# Altium project pca10059.PrjPCB
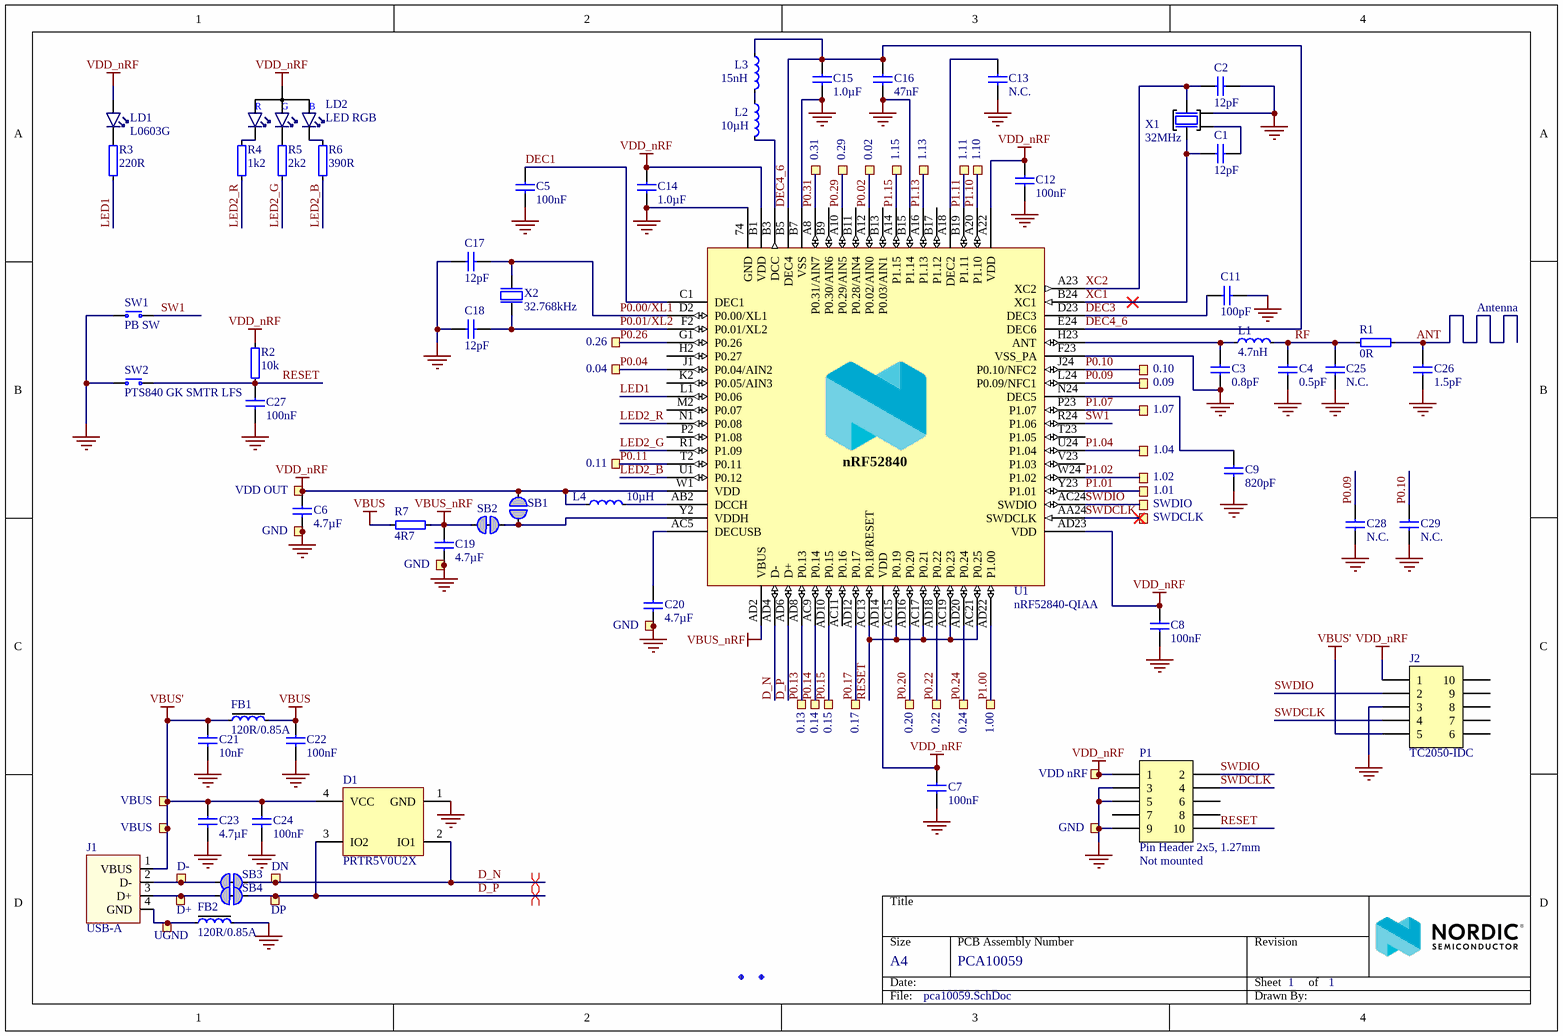
[diagram p0: pca10059.SchDoc]
SurfaceFinish: ENIG; SoldermaskColor: Blue; SilkscreenColor: White; PCARevision: 2.1.1; ProductName: nRF52840 Dongle; PCBRevision: 0379RUBR; PCBNumber: 400250; PCAName: PCA10059; Organization: Nordic Semiconductor; NrOfLayers: 2; BoardTitle: nRF52840 USB Dongle; BoardThickness: 2.0mm; Designer: RUBR; Compliance: RoHS, REACH, Halogen-Free; Dielectric: FR-4 Halogen-Free
1 sheet, 97 parts. Net scope: global (net labels, ports and power ports of the same name join across sheets).
Board file: 400250.PcbDoc

## Sheet pca10059.SchDoc: =BoardTitle
size A4; Organization: Nordic Semiconductor; Revision: 2.1.1; SheetNumber: 1; SheetTotal: 1; Author: RUBR; CompanyName: Nordic Semiconductor; DrawnBy: RUBR; DocumentSize: A4

### Parts
0.02  CH  [Castellated_Hole_0.9mm]  (value not drawn)  (no BOM)
0.04  Ø1.0mm,SMD  [TP_SMD_D1.0mm]  (value not drawn)  (no BOM)
0.09  CH  [Castellated_Hole_0.9mm]  (value not drawn)  (no BOM)
0.10  CH  [Castellated_Hole_0.9mm]  (value not drawn)  (no BOM)
0.11  Ø1.0mm,SMD  [TP_SMD_D1.0mm]  (value not drawn)  (no BOM)
0.13  CH  [Castellated_Hole_0.9mm]  (value not drawn)  (no BOM)
0.14  Ø1.0mm,SMD  [TP_SMD_D1.0mm]  (value not drawn)  (no BOM)
0.15  CH  [Castellated_Hole_0.9mm]  (value not drawn)  (no BOM)
0.17  CH  [Castellated_Hole_0.9mm]  (value not drawn)  (no BOM)
0.20  CH  [Castellated_Hole_0.9mm]  (value not drawn)  (no BOM)
0.22  CH  [Castellated_Hole_0.9mm]  (value not drawn)  (no BOM)
0.24  CH  [Castellated_Hole_0.9mm]  (value not drawn)  (no BOM)
0.26  Ø1.0mm,SMD  [TP_SMD_D1.0mm]  (value not drawn)  (no BOM)
0.29  CH  [Castellated_Hole_0.9mm]  (value not drawn)  (no BOM)
0.31  CH  [Castellated_Hole_0.9mm]  (value not drawn)  (no BOM)
1.00  CH  [Castellated_Hole_0.9mm]  (value not drawn)  (no BOM)
1.01  Ø1.0mm,SMD  [TP_SMD_D1.0mm]  (value not drawn)  (no BOM)
1.02  Ø1.0mm,SMD  [TP_SMD_D1.0mm]  (value not drawn)  (no BOM)
1.04  Ø1.0mm,SMD  [TP_SMD_D1.0mm]  (value not drawn)  (no BOM)
1.07  Ø1.0mm,SMD  [TP_SMD_D1.0mm]  (value not drawn)  (no BOM)
1.10  CH  [Castellated_Hole_0.9mm]  (value not drawn)  (no BOM)
1.11  Ø1.0mm,SMD  [TP_SMD_D1.0mm]  (value not drawn)  (no BOM)
1.13  CH  [Castellated_Hole_0.9mm]  (value not drawn)  (no BOM)
1.15  CH  [Castellated_Hole_0.9mm]  (value not drawn)  (no BOM)
C1  12pF  [CAPC0603X03L_C]
C2  12pF  [CAPC0603X03L_C]
C3  0.8pF  [CAPC0603X03L_C]
C4  0.5pF  [CAPC0603X03L_C]
C5  100nF  [CAPC0603X03L_C]
C6  4.7µF  [CAPC1608X06L]
C7  100nF  [CAPC0603X03L_C]
C8  100nF  [CAPC0603X03L_C]
C9  820pF  [CAPC0603X03L_C]
C11  100pF  [CAPC0603X03L_C]
C12  100nF  [CAPC0603X03L_C]
C13  N.C.  [CAPC0603X03L_C_NC]
C14  1.0µF  [CAPC1608X06L]
C15  1.0µF  [CAPC1608X06L]
C16  47nF  [CAPC0603X03L_C]
C17  12pF  [CAPC0603X03L_C]
C18  12pF  [CAPC0603X03L_C]
C19  4.7µF  [CAPC1005X04L]
C20  4.7µF  [CAPC1608X06L]
C21  10nF  [CAPC0603X03L_C]
C22  100nF  [CAPC0603X03L_C]
C23  4.7µF  [CAPC1005X04L]
C24  100nF  [CAPC0603X03L_C]
C25  N.C.  [CAPC0603X03L_C_NC]
C26  1.5pF  [CAPC0603X03L_C]
C27  100nF  [CAPC0603X03L_C]
C28  N.C.  [CAPC1005X04L_NC]
C29  N.C.  [CAPC1005X04L_NC]
D1  PRTR5V0U2X  [SOT190P230X110-4L]
D+  Ø1.0mm,SMD  [TP_SMD_D1.0mm]  (value not drawn)  (no BOM)
D-  Ø1.0mm,SMD  [TP_SMD_D1.0mm]  (value not drawn)  (no BOM)
DN  Ø1.0mm,SMD  [TP_SMD_D1.0mm]  (value not drawn)  (no BOM)
DP  Ø1.0mm,SMD  [TP_SMD_D1.0mm]  (value not drawn)  (no BOM)
FB1  120R/0.85A  [INDC0603X03L_C]
FB2  120R/0.85A  [INDC0603X03L_C]
Fid1  Fiducial mark  [Fiducial_Square]  (value not drawn)
Fid2  Fiducial mark  [Fiducial]  (value not drawn)
GND1  GND  [Castellated_Hole_0.9mm]  (no BOM)
GND2  GND  [Castellated_Hole_0.9mm_S]  (no BOM)
GND3  GND  [Castellated_Hole_0.9mm_S]  (no BOM)
GND4  GND  [TP_SMD_D1.0mm]  (no BOM)
J1  USB-A  [USB-A-PCB]  (no BOM)
J2  TC2050-IDC  [TC2050-IDC-NLFP]  (no BOM)
L1  4.7nH  [INDC0603X03L_C]
L2  10µH  [INDC1608X06L]
L3  15nH  [INDC1005X04L]
L4  10µH  [INDC1608X06L]
LD1  L0603G  [LED_0603_G]
LD2  LED RGB  [LED_RGB_0603]
P1  Pin Header 2x5, 1.27mm  Assembly: Not mounted  [HDR_2x5-SMD-1.27mm-NC]
R1  0R  [RESC0603X03L_C]
R2  10k  [RESC0603X03L_C]
R3  220R  [RESC0603X03L_C]
R4  1k2  [RESC0603X03L_C]
R5  2k2  [RESC0603X03L_C]
R6  390R  [RESC0603X03L_C]
R7  4R7  [RESC0603X03L_C]
SB1  Solderbridge  [Solderbridge]  (value not drawn)  (no BOM)
SB2  Solderbridge  [Solderbridge_Shorted]  (value not drawn)  (net tie, no BOM)
SB3  Solderbridge  [Solderbridge_Shorted]  (value not drawn)  (net tie, no BOM)
SB4  Solderbridge  [Solderbridge_Shorted]  (value not drawn)  (net tie, no BOM)
SW1  PB SW  [C&K_PTS810]
SW2  PTS840 GK SMTR LFS  [EVQP7A_J_B_K]
SWDCLK  CH  [Castellated_Hole_0.9mm_D]  (value not drawn)  (no BOM)
SWDIO  CH  [Castellated_Hole_0.9mm_D]  (value not drawn)  (no BOM)
U1  nRF52840-QIAA  [AQFN50P700X700X85_HS-74N]
UGND  Ø1.0mm,SMD  [TP_SMD_D1.0mm]  (value not drawn)  (no BOM)
VBUS1  VBUS  [Castellated_Hole_0.9mm]  (no BOM)
VBUS2  VBUS  [TP_SMD_D1.0mm]  (no BOM)
VDD_nRF  Ø1.0mm,SMD  [TP_SMD_D1.0mm]  (value not drawn)  (no BOM)
VDD_OUT  CH  [Castellated_Hole_0.9mm]  (value not drawn)  (no BOM)
X1  32MHz  [BT-XTAL_2016]
X2  32.768kHz  [XTAL_2012]

### Nets
GND: C2.2 C3.1 C4.1 C5.2 C6.2 C7.2 C8.2 C9.2 C11.2 C12.2 C13.2 C14.2 C15.1 C16.2 C17.2 C18.2 C19.2 C20.2 C21.1 C22.1 C23.1 C24.1 C25.2 C26.1 C27.1 C28.1 C29.2 D1.1(GND) FB2.2 GND1.1 GND2.1 GND3.1 GND4.1 J2.3 P1.3 P1.5 P1.9 SW1.2(COM) SW2.2(COM) U1.74(GND) U1.B7(VSS) U1.B15(P1.14) U1.F23(VSS_PA) X1.2(GND)
VBUS: C22.2 FB1.2 R7.2
VBUS': C21.2 C23.2 C24.2 D1.4(VCC) FB1.1 J1.1(VBUS) J2.5 VBUS1.1 VBUS2.1
VBUS_nRF: C19.1 R7.1 SB2.2 U1.AD2(VBUS)
VDD_nRF: C6.1 C7.1 C8.1 C12.1 C14.1 J2.1 L4.1 LD1.2(A) LD2.4(A) P1.1 R2.2 SB1.1 U1.A22(VDD) U1.AD14(VDD) U1.AD23(VDD) U1.B1(VDD) U1.W1(VDD) VDD_nRF.1 VDD_OUT.1
ANT: C26.2 R1.2
D_N: D1.2(IO1) DN.1 SB3.1 U1.AD4(D-)
D_P: D1.3(IO2) DP.1 SB4.1 U1.AD6(D+)
DEC1: C5.1 U1.C1(DEC1)
DEC3: C11.1 U1.D23(DEC3)
DEC4_6: C15.2 C16.1 L3.1 U1.B5(DEC4) U1.E24(DEC6)
LED1: R3.1 U1.L1(P0.06)
LED2_B: R6.1 U1.U1(P0.12)
LED2_G: R5.1 U1.R1(P1.09)
LED2_R: R4.1 U1.N1(P0.08)
P0.00/XL1: C17.1 U1.D2(P0.00/XL1) X2.1(inp)
P0.01/XL2: C18.1 U1.F2(P0.01/XL2) X2.2(out)
P0.02: 0.02.1 U1.A12(P0.02/AIN0)
P0.04: 0.04.1 U1.J1(P0.04/AIN2)
P0.09: 0.09.1 C28.2 U1.L24(P0.09/NFC1)
P0.10: 0.10.1 C29.1 U1.J24(P0.10/NFC2)
P0.11: 0.11.1 U1.T2(P0.11)
P0.13: 0.13.1 U1.AD8(P0.13)
P0.14: 0.14.1 U1.AC9(P0.14)
P0.15: 0.15.1 U1.AD10(P0.15)
P0.17: 0.17.1 U1.AD12(P0.17)
P0.20: 0.20.1 U1.AD16(P0.20)
P0.22: 0.22.1 U1.AD18(P0.22)
P0.24: 0.24.1 U1.AD20(P0.24)
P0.26: 0.26.1 U1.G1(P0.26)
P0.29: 0.29.1 U1.A10(P0.29/AIN5)
P0.31: 0.31.1 U1.A8(P0.31/AIN7)
P1.00: 1.00.1 U1.AD22(P1.00)
P1.01: 1.01.1 U1.Y23(P1.01)
P1.02: 1.02.1 U1.W24(P1.02)
P1.04: 1.04.1 U1.U24(P1.04)
P1.07: 1.07.1 U1.P23(P1.07)
P1.10: 1.10.1 U1.A20(P1.10)
P1.11: 1.11.1 U1.B19(P1.11)
P1.13: 1.13.1 U1.A16(P1.13)
P1.15: 1.15.1 U1.A14(P1.15)
RESET: C27.2 P1.10 R2.1 SW2.1(N.O) U1.AC13(P0.18/RESET) U1.AC15(P0.19) U1.AC17(P0.21) U1.AC19(P0.23) U1.AC21(P0.25)
RF: C4.2 C25.1 L1.2 R1.1
SW1: SW1.1(N.O) U1.R24(P1.06)
SWDCLK: J2.4 P1.4 SWDCLK.1 U1.AA24(SWDCLK)
SWDIO: J2.2 P1.2 SWDIO.1 U1.AC24(SWDIO)
XC1: C1.1 U1.B24(XC1) X1.1(IN)
XC2: C2.1 U1.A23(XC2) X1.3(OUT)
NetC1_2: C1.2 X1.4(GND)
NetC3_2: C3.2 L1.1 U1.H23(ANT)
NetC9_1: C9.1 U1.N24(DEC5)
NetC13_1: C13.1 U1.A18(DEC2)
NetC20_1: C20.1 U1.AC5(DECUSB)
NetD+_1: D+.1 J1.3(D+) SB4.2
NetD-_1: D-.1 J1.2(D-) SB3.2
NetFB2_1: FB2.1 J1.4(GND) UGND.1
NetL2_1: L2.1 L3.2
NetL2_2: L2.2 U1.B3(DCC)
NetL4_2: L4.2 U1.AB2(DCCH)
NetLD1_1: LD1.1(C) R3.2
NetLD2_1: LD2.1(C_RED) R4.2
NetLD2_2: LD2.2(C_GREEN) R5.2
NetLD2_3: LD2.3(C_BLUE) R6.2
NetSB1_2: SB1.2 SB2.1 U1.Y2(VDDH)

Not connected (* = marked no-connect by the designer): J2 6 7 8 9 10; P1 6 7 8; U1 AC11(P0.16) B9(P0.30/AIN6) B11(P0.28/AIN4) B13(P0.03/AIN1) B17(P1.12) H2(P0.27) K2(P0.05/AIN3) M2(P0.07) P2(P1.08) T23(P1.05) V23(P1.03)

### Layout directives
differential pair: D_N, D_P

### Notes on the sheet
- Antenna
- Title
- Size
- Date:
- A4
- PCB Assembly Number
- Sheet         of
- Revision
- File:
- Drawn By:
- (in symbol APHF1608LSEEQBDZGKC) R; G; B
- (in symbol nRF52840-QIAAF0) nRF52840

### Library data of the parts
0.02 0.09 0.10 0.13 0.15 0.17 0.20 0.22 0.24 0.29 0.31 1.00 1.10 1.13 1.15 GND1 VBUS1 VDD_OUT = Castellated Hole 0.9mm: Manufacturer: N.A.; Pad Count: 1; Part Number: Castellated Hole 0.9mm; Manufacturer Part Number: N.A.; LatestRevisionDate: 2016-08-22; Published: 2016-08-22; Note: N.A.; Artikkelnr Noca: N.A.; Part number IPS: N.A.; ComponentLink1Description: Datasheet; ComponentLink1URL: N.A.; ComponentLink2Description: Supplier link; ComponentLink2URL: N.A.; HelpURL: N.A.; Supplier 1: N.A.; Supplier Part Number 1: N.A.; Supplier 2: N.A.; Supplier Part Number 2: N.A.; Footprint Doc: N.A.; PartId: 100500565; Component Class: Connectors; Author: rsk; Part number Norautron: N.A.
  0.02 0.09 0.10 0.13 0.15 0.17 0.20 0.22 0.24 0.29 0.31 1.00 1.10 1.13 1.15 VDD_OUT: Value: CH
  GND1: Value: GND
  VBUS1: Value: VBUS
0.04 0.11 0.14 0.26 1.01 1.02 1.04 1.07 1.11 D+ D- DN DP GND4 UGND VBUS2 VDD_nRF = TP_SMD_Ø1.0MM: 1.0mm circular SMD testpad; Manufacturer: Nordic Semiconductor; Manufacturer Part Number: N.A.; Pad Count: 1; Part Number: TP_SMD_Ø1.0MM; Footprint Doc: TP_SMD_Ø1.0mm; LatestRevisionDate: 2021-03-05; Published: 2013-06-11; Note: N.A.; Artikkelnr Noca: N.A.; Part number IPS: N.A.; ComponentLink1Description: Datasheet; ComponentLink1URL: N.A.; ComponentLink2Description: Supplier link; ComponentLink2URL: N.A.; HelpURL: N.A.; Supplier 1: N.A.; Supplier Part Number 1: N.A.; Supplier 2: N.A.; Supplier Part Number 2: N.A.; PartId: 100500475; Component Class: Connectors; Author: rsk; Part number Norautron: N.A.
  0.04 0.11 0.14 0.26 1.01 1.02 1.04 1.07 1.11 D+ D- DN DP UGND VDD_nRF: Value: Ø1.0mm,SMD
  GND4: Value: GND
  VBUS2: Value: VBUS
C1 C2 C17 C18 = C0201-12p: Capacitor, NP0, ±2%; Manufacturer: N.A.; Part number IPS: 00000007848; Note: 25V; Pad Count: 2; Part Number: C0201-12p; Manufacturer Part Number: N.A.; LatestRevisionDate: 2017-11-09; Published: 2014-11-13; Value: 12pF; Artikkelnr Noca: N.A.; Footprint Doc: 0201; ComponentLink1Description: Datasheet; ComponentLink1URL: N.A.; ComponentLink2Description: Supplier link; ComponentLink2URL: N.A.; HelpURL: N.A.; Supplier 1: N.A.; Supplier Part Number 1: N.A.; Supplier 2: N.A.; Supplier Part Number 2: N.A.; PartId: 100200033; Component Class: Capacitors; Author: rsk; Part number Norautron: N.A.
C3 = C0201-0.8p: Capacitor, NP0, ±0.05pF, 50V; Manufacturer: Murata; Manufacturer Part Number: GJM0335C1HR80WB01; Part number IPS: 80000001975; Artikkelnr Noca: N.A.; Pad Count: 2; Part Number: C0201-0.8p; LatestRevisionDate: 2018-10-22; Published: 2014-11-13; Value: 0.8pF; Note: 50V; Footprint Doc: 0201; ComponentLink1Description: Datasheet; ComponentLink1URL: N.A.; ComponentLink2Description: Supplier link; ComponentLink2URL: N.A.; HelpURL: N.A.; Supplier 1: N.A.; Supplier Part Number 1: N.A.; Supplier 2: N.A.; Supplier Part Number 2: N.A.; PartId: 100200012; Component Class: Capacitors; Author: rsk; Part number Norautron: N.A.
C4 = C0201-0.5p: Capacitor, NP0, ±0.05pF; Manufacturer: N.A.; Note: 50V; Pad Count: 2; Part Number: C0201-0.5p; Manufacturer Part Number: N.A.; LatestRevisionDate: 2018-10-22; Published: 2014-11-13; Value: 0.5pF; Artikkelnr Noca: N.A.; Footprint Doc: 0201; Part number IPS: N.A.; ComponentLink1Description: Datasheet; ComponentLink1URL: N.A.; ComponentLink2Description: Supplier link; ComponentLink2URL: N.A.; HelpURL: N.A.; Supplier 1: N.A.; Supplier Part Number 1: N.A.; Supplier 2: N.A.; Supplier Part Number 2: N.A.; PartId: 100200008; Component Class: Capacitors; Author: rsk; Part number Norautron: N.A.
C5 C7 C8 C12 C22 C24 C27 = C0201-100n: Capacitor, X5R, ±10%; Manufacturer: N.A.; Part number IPS: 00000001248, 00000002505; Note: 16V; Pad Count: 2; Part Number: C0201-100n; Manufacturer Part Number: N.A.; LatestRevisionDate: 2017-11-09; Published: 2014-11-13; Value: 100nF; Artikkelnr Noca: N.A.; Footprint Doc: 0201; ComponentLink1Description: Datasheet; ComponentLink1URL: N.A.; ComponentLink2Description: Supplier link; ComponentLink2URL: N.A.; HelpURL: N.A.; Supplier 1: N.A.; Supplier Part Number 1: N.A.; Supplier 2: N.A.; Supplier Part Number 2: N.A.; PartId: 100200078; Component Class: Capacitors; Author: rsk; Part number Norautron: N.A.
C6 C20 = C0603-4µ7: Capacitor, X5R, ±10%; Manufacturer: N.A.; Part number IPS: 00000007783; Note: 6.3V; Artikkelnr Noca: 20069060; Pad Count: 2; Part Number: C0603-4µ7; Manufacturer Part Number: N.A.; LatestRevisionDate: 2009-11-23; Published: 2009-05-08; Value: 4.7µF; Footprint Doc: 0603; ComponentLink1Description: Datasheet; ComponentLink1URL: N.A.; ComponentLink2Description: Supplier link; ComponentLink2URL: N.A.; HelpURL: N.A.; Supplier 1: N.A.; Supplier Part Number 1: N.A.; Supplier 2: N.A.; Supplier Part Number 2: N.A.; PartId: 100200274; Component Class: Capacitors; Author: rsk; Part number Norautron: N.A.
C9 = C0201-820p: Capacitor, X7R, ±10%; Manufacturer: N.A.; Part number IPS: 00000001249; Note: 25V; Pad Count: 2; Part Number: C0201-820p; Manufacturer Part Number: N.A.; LatestRevisionDate: 2017-11-09; Published: 2014-11-13; Value: 820pF; Artikkelnr Noca: N.A.; Footprint Doc: 0201; ComponentLink1Description: Datasheet; ComponentLink1URL: N.A.; ComponentLink2Description: Supplier link; ComponentLink2URL: N.A.; HelpURL: N.A.; Supplier 1: N.A.; Supplier Part Number 1: N.A.; Supplier 2: N.A.; Supplier Part Number 2: N.A.; PartId: 100200055; Component Class: Capacitors; Author: rsk; Part number Norautron: N.A.
C11 = C0201-100p: Capacitor, NP0, ±2%, 25V; Manufacturer: Murata; Manufacturer Part Number: GRM0335C1E101GA01; Part number IPS: 00000007853; Artikkelnr Noca: N.A.; Pad Count: 2; Part Number: C0201-100p; LatestRevisionDate: 2019-04-16; Published: 2019-04-16; Value: 100pF; Note: 25V; Footprint Doc: 0201; ComponentLink1Description: Datasheet; ComponentLink1URL: N.A.; ComponentLink2Description: Supplier link; ComponentLink2URL: N.A.; HelpURL: N.A.; Supplier 1: N.A.; Supplier Part Number 1: N.A.; Supplier 2: N.A.; Supplier Part Number 2: N.A.; PartId: 100200044; Component Class: Capacitors; Author: rsk; Part number Norautron: N.A.
C13 C25 = C0201-N.C.: Not mounted; Manufacturer: N.A.; Note: Chip Cap; Assembly: Not mounted; Pad Count: 2; Part Number: C0201-N.C.; Manufacturer Part Number: N.A.; LatestRevisionDate: 2014-11-13; Published: 2014-11-13; Value: N.C.; Artikkelnr Noca: N.A.; Footprint Doc: 0201; Part number IPS: N.A.; ComponentLink1Description: Datasheet; ComponentLink1URL: N.A.; ComponentLink2Description: Supplier link; ComponentLink2URL: N.A.; HelpURL: N.A.; Supplier 1: N.A.; Supplier Part Number 1: N.A.; Supplier 2: N.A.; Supplier Part Number 2: N.A.; PartId: 100200001; Component Class: Capacitors; Author: rsk; Part number Norautron: N.A.
C14 C15 = C0603-1µ0: Capacitor, X7R, ±10%; Manufacturer: N.A.; Part number IPS: 00000000616; Note: 16V; Artikkelnr Noca: 20039282; Pad Count: 2; Part Number: C0603-1µ0; Manufacturer Part Number: N.A.; LatestRevisionDate: 2013-06-05; Published: 2009-05-08; Value: 1.0µF; Footprint Doc: 0603; ComponentLink1Description: Datasheet; ComponentLink1URL: N.A.; ComponentLink2Description: Supplier link; ComponentLink2URL: N.A.; HelpURL: N.A.; Supplier 1: N.A.; Supplier Part Number 1: N.A.; Supplier 2: N.A.; Supplier Part Number 2: N.A.; PartId: 100200271; Component Class: Capacitors; Author: rsk; Part number Norautron: N.A.
C16 = C0201-47n: Capacitor, X5R, ±10%; Manufacturer: N.A.; Part number IPS: 00000001250; Note: 10V; Pad Count: 2; Part Number: C0201-47n; LatestRevisionDate: 2017-11-09; Published: 2014-11-13; Value: 47nF; Footprint Doc: 0201; Manufacturer Part Number: N.A.; Artikkelnr Noca: N.A.; ComponentLink1Description: Datasheet; ComponentLink1URL: N.A.; ComponentLink2Description: Supplier link; ComponentLink2URL: N.A.; HelpURL: N.A.; Supplier 1: N.A.; Supplier Part Number 1: N.A.; Supplier 2: N.A.; Supplier Part Number 2: N.A.; PartId: 100200074; Component Class: Capacitors; Author: rsk; Part number Norautron: N.A.
C19 C23 = C0402-4µ7: Capacitor, X5R, ±20%; Manufacturer: N.A.; Part number IPS: 00000001251, 00000007165; Note: 10V; Artikkelnr Noca: 20039482; Pad Count: 2; Part Number: C0402-4µ7; Manufacturer Part Number: N.A.; LatestRevisionDate: 2017-11-09; Published: 2009-05-08; Value: 4.7µF; Footprint Doc: 0402; ComponentLink1Description: Datasheet; ComponentLink1URL: N.A.; ComponentLink2Description: Supplier link; ComponentLink2URL: N.A.; HelpURL: N.A.; Supplier 1: Digi-Key; Supplier Part Number 1: 490-13252-1-ND; Supplier 2: N.A.; Supplier Part Number 2: N.A.; PartId: 100200193; Component Class: Capacitors; Author: rsk; Part number Norautron: N.A.
C21 = C0201-10n: Capacitor, X7R, ±10%; Manufacturer: N.A.; Part number IPS: 00000003480; Note: 10V; Pad Count: 2; Part Number: C0201-10n; Manufacturer Part Number: N.A.; LatestRevisionDate: 2017-11-09; Published: 2014-11-13; Value: 10nF; Artikkelnr Noca: N.A.; Footprint Doc: 0201; ComponentLink1Description: Datasheet; ComponentLink1URL: N.A.; ComponentLink2Description: Supplier link; ComponentLink2URL: N.A.; HelpURL: N.A.; Supplier 1: N.A.; Supplier Part Number 1: N.A.; Supplier 2: N.A.; Supplier Part Number 2: N.A.; PartId: 100200067; Component Class: Capacitors; Author: rsk; Part number Norautron: N.A.
C26 = C0201-1.5p: Capacitor, NP0, ±0.1pF; Manufacturer: N.A.; Part number IPS: 00000007107; Note: 50V; Pad Count: 2; Part Number: C0201-1.5p; Manufacturer Part Number: N.A.; LatestRevisionDate: 2017-11-09; Published: 2014-11-13; Value: 1.5pF; Artikkelnr Noca: N.A.; Footprint Doc: 0201; ComponentLink1Description: Datasheet; ComponentLink1URL: N.A.; ComponentLink2Description: Supplier link; ComponentLink2URL: N.A.; HelpURL: N.A.; Supplier 1: N.A.; Supplier Part Number 1: N.A.; Supplier 2: N.A.; Supplier Part Number 2: N.A.; PartId: 100200017; Component Class: Capacitors; Author: rsk; Part number Norautron: N.A.
C28 C29 = C0402-N.C.: Not mounted; Manufacturer: N.A.; Assembly: Not mounted; Note: Chip Cap; Pad Count: 2; Part Number: C0402-N.C.; Manufacturer Part Number: N.A.; Footprint Doc: 0402; LatestRevisionDate: 2009-05-08; Published: 2009-05-08; Value: N.C.; Artikkelnr Noca: N.A.; Part number IPS: N.A.; ComponentLink1Description: Datasheet; ComponentLink1URL: N.A.; ComponentLink2Description: Supplier link; ComponentLink2URL: N.A.; HelpURL: N.A.; Supplier 1: N.A.; Supplier Part Number 1: N.A.; Supplier 2: N.A.; Supplier Part Number 2: N.A.; PartId: 100200105; Component Class: Capacitors; Author: rsk; Part number Norautron: N.A.
D1 = PRTR5V0U2X: Ultra low capacitance double rail-to-rail ESD protection diode; Manufacturer: NXP Semiconductors; Part number IPS: 00000009951; Note: N.A.; Artikkelnr Noca: 10069015; Pad Count: 4; Part Number: PRTR5V0U2X; Manufacturer Part Number: PRTR5V0U2X; LatestRevisionDate: 2017-11-09; Published: 2012-06-11; Value: PRTR5V0U2X; Footprint Doc: SOT-143B; ComponentLink1Description: Datasheet; ComponentLink1URL: N.A.; ComponentLink2Description: Supplier link; ComponentLink2URL: N.A.; HelpURL: http://www.farnell.com/datasheets/109718.pdf; Supplier 1: Digi-Key; Supplier Part Number 1: 568-4140-1-ND; Supplier 2: Farnell; Supplier Part Number 2: 152-4157; PartId: 101300082; Component Class: Semiconductors; Author: rsk; Part number Norautron: N.A.
FB1 FB2 = FB0201-120R@100M-850mA: Ferrite Bead, 120 Ohm @ 100MHz, 850mA, 150 mOhm Max; Manufacturer: Taiyo Yuden; Manufacturer Part Number: BKP0603HS121-T; Part number IPS: 00000001252; Note: Chip EMIFIL Inductor Type Chip Ferrite Bead; Artikkelnr Noca: N.A.; Pad Count: 2; Part Number: FB0201-120R@100M-850mA; Footprint Doc: 0201; LatestRevisionDate: 2019-01-29; Published: 2016-08-23; Value: 120R/0.85A; ComponentLink1Description: Datasheet; ComponentLink1URL: N.A.; ComponentLink2Description: Supplier link; HelpURL: http://ds.yuden.co.jp/TYCOMPAS/ut/detail.do?productNo=BKP0603HS121-T&fileName=BKP0603HS121-T_SS&mode=specSheetDownload; ComponentLink2URL: N.A.; Supplier 1: Digi-Key; Supplier Part Number 1: 587-3286-1-ND; Supplier 2: N.A.; Supplier Part Number 2: N.A.; PartId: 100300097; Component Class: Inductors; Author: rsk; Part number Norautron: N.A.
Fid1 = Fid-Mark-Square: Manufacturer: N.A.; Value: N.A.; Pad Count: 1; Part Number: Fid-Mark-Square; Manufacturer Part Number: N.A.; LatestRevisionDate: 2017-01-30; Published: 2009-12-12; Note: N.A.; Artikkelnr Noca: N.A.; Footprint Doc: Fiducial; Part number IPS: N.A.; ComponentLink1Description: Datasheet; ComponentLink1URL: N.A.; ComponentLink2Description: Supplier link; ComponentLink2URL: N.A.; HelpURL: N.A.; Supplier 1: N.A.; Supplier Part Number 1: N.A.; Supplier 2: N.A.; Supplier Part Number 2: N.A.; PartId: 100500074; Component Class: Connectors; Author: rsk; Part number Norautron: N.A.
Fid2 = Fid-Mark: Manufacturer: N.A.; Value: N.A.; Pad Count: 1; Part Number: Fid-Mark; Manufacturer Part Number: N.A.; LatestRevisionDate: 2009-12-12; Published: 2009-12-12; Note: N.A.; Artikkelnr Noca: N.A.; Footprint Doc: Fiducial; ComponentLink1Description: Datasheet; ComponentLink1URL: N.A.; ComponentLink2Description: Supplier link; ComponentLink2URL: N.A.; HelpURL: N.A.; Part number IPS: N.A.; Supplier 1: N.A.; Supplier Part Number 1: N.A.; Supplier 2: N.A.; Supplier Part Number 2: N.A.; PartId: 100500073; Component Class: Connectors; Author: rsk; Part number Norautron: N.A.
GND2 GND3 = Castellated Hole 0.9mm_S: Castellated Hole 0.9mm; Manufacturer: N.A.; Pad Count: 1; Part Number: Castellated Hole 0.9mm_S; Manufacturer Part Number: N.A.; LatestRevisionDate: 2018-01-24; Published: 2018-01-24; Value: GND; Note: N.A.; Artikkelnr Noca: N.A.; Part number IPS: N.A.; ComponentLink1Description: Datasheet; ComponentLink1URL: N.A.; ComponentLink2Description: Supplier link; ComponentLink2URL: N.A.; HelpURL: N.A.; Supplier 1: N.A.; Supplier Part Number 1: N.A.; Supplier 2: N.A.; Supplier Part Number 2: N.A.; Footprint Doc: N.A.; PartId: 100500566; Component Class: Connectors; Author: rsk; Part number Norautron: N.A.
J1 = USB-A-PCB: USB-A PCB footprint; Manufacturer: N.A.; Pad Count: 4; Part Number: USB-A-PCB; Manufacturer Part Number: N.A.; LatestRevisionDate: 2014-06-04; Published: 2014-06-04; Value: USB-A; Note: N.A.; Artikkelnr Noca: N.A.; Footprint Doc: USB-A-PCB; ComponentLink1Description: Datasheet; ComponentLink1URL: N.A.; ComponentLink2Description: Supplier link; ComponentLink2URL: N.A.; HelpURL: N.A.; Part number IPS: N.A.; Supplier 1: N.A.; Supplier Part Number 1: N.A.; Supplier 2: N.A.; Supplier Part Number 2: N.A.; PartId: 100500219; Component Class: Connectors; Author: rsk; Part number Norautron: N.A.
J2 = TC2050-IDC-NLFP: CBL PLUG-OF-NAILS 10-PIN; Manufacturer: Tag-Connect LLC; Artikkelnr Noca: N.A.; Pad Count: 10; Part Number: TC2050-IDC-NLFP; Manufacturer Part Number: TC2050-IDC-NLFP; LatestRevisionDate: 2012-11-21; Published: 2012-11-21; Value: TC2050-IDC; Footprint Doc: TC2050-IDC-NLFP; ComponentLink1Description: Datasheet; ComponentLink1URL: N.A.; ComponentLink2Description: Supplier link; ComponentLink2URL: N.A.; HelpURL: http://www.tag-connect.com/Materials/TC2050-IDC%20Datasheet.pdf; Part number IPS: N.A.; Supplier 1: Digi-Key; Supplier Part Number 1: TC2050-IDC-NL-ND; Supplier 2: N.A.; Supplier Part Number 2: N.A.; PartId: 100500463; Component Class: Connectors; Author: rsk; Note: N.A.; Part number Norautron: N.A.
L1 = L0201-4n7: Inductor, 350mA, ±3%; Manufacturer: Murata; Manufacturer Part Number: LQP03TN4N7H02D; Part number IPS: 00000001792; Note: N.A.; Pad Count: 2; Part Number: L0201-4n7; LatestRevisionDate: 2013-04-10; Published: 2013-04-10; Value: 4.7nH; Artikkelnr Noca: N.A.; Footprint Doc: 0201; ComponentLink1Description: Datasheet; ComponentLink2Description: Supplier link; ComponentLink1URL: N.A.; HelpURL: N.A.; ComponentLink2URL: N.A.; Supplier 1: N.A.; Supplier Part Number 1: N.A.; Supplier 2: N.A.; Supplier Part Number 2: N.A.; PartId: 100300024; Component Class: Inductors; Author: rsk; Part number Norautron: N.A.
L2 L4 = L0603-10µ: Inductor, 80mA, ±10%; Manufacturer: Taiyo Yuden; Manufacturer Part Number: LBMF1608T100K; Part number IPS: 00000007794; Part number Norautron: N.A.; Note: LBMF1608T100K 10µH 80mA 0603; Artikkelnr Noca: 33029314; Pad Count: 2; Part Number: L0603-10µ; LatestRevisionDate: 2012-09-19; Published: 2010-02-24; Value: 10µH; Footprint Doc: 0603; ComponentLink1Description: Datasheet; ComponentLink1URL: N.A.; ComponentLink2Description: Supplier link; HelpURL: http://www.yuden.co.jp/ut/product/pdf/elb2_e.pdf; ComponentLink2URL: N.A.; Supplier 1: Digi-Key; Supplier Part Number 1: 587-1714-1-ND; Supplier 2: Farnell; Supplier Part Number 2: 178-6105; PartId: 100300078; Component Class: Inductors; Author: rsk
L3 = L0402-15n: Inductor, 320mA, ±5%; Manufacturer: Taiyo Yuden; Manufacturer Part Number: HK100515NJ-T; Part number IPS: 00000001262; Part number Norautron: N.A.; Note: High frequency chip inductor ±10%; Artikkelnr Noca: 33029323; Pad Count: 2; Part Number: L0402-15n; LatestRevisionDate: 2012-09-19; Published: 2010-07-12; Value: 15nH; Footprint Doc: 0402; ComponentLink1Description: Datasheet; ComponentLink1URL: N.A.; ComponentLink2Description: Supplier link; HelpURL: http://www.yuden.co.jp/productdata/catalog/en/mlci04_e.pdf; ComponentLink2URL: N.A.; Supplier 1: Digi-Key; Supplier Part Number 1: 587-1521-1-ND; Supplier 2: Farnell; Supplier Part Number 2: 658-1328; PartId: 100300056; Component Class: Inductors; Author: rsk
LD1 = VS 25C7M5: LED, Green, 0603, 573nm, Vf=2.0V, 24mcd, - 40 to +85°C; Manufacturer: Victory Electronics; Part number IPS: 00000001274, 00000009961; Note: N.A.; Artikkelnr Noca: 13019193; Pad Count: 2; Part Number: VS 25C7M5; Manufacturer Part Number: VS 25C7M5; LatestRevisionDate: 2020-10-23; Published: 2017-08-21; Value: L0603G; Footprint Doc: 0603; ComponentLink1Description: Datasheet; ComponentLink1URL: N.A.; ComponentLink2Description: Supplier link; ComponentLink2URL: N.A.; HelpURL: \\hizz\pro\app9717\Datasheet\optoelectronics\Victory Electronics\VS 25C7M5.pdf; Supplier 1: EC Partner; Supplier Part Number 1: N.A.; Supplier 2: N.A.; Supplier Part Number 2: N.A.; PartId: 101400097; Component Class: Optoelectronics; Author: rsk; Part number Norautron: N.A.
LD2 = APHF1608LSEEQBDZGKC: RGB LED 1.60 mm x 0.80 mm SMD; Manufacturer: Kingbright Company LLC; Part number IPS: 00000001254; Note: N.A.; Pad Count: 4; Part Number: APHF1608LSEEQBDZGKC; Manufacturer Part Number: APHF1608LSEEQBDZGKC; LatestRevisionDate: 2017-11-09; Published: 2017-09-18; Value: LED RGB; Artikkelnr Noca: N.A.; Footprint Doc: LED_RGB_0603; ComponentLink1Description: Datasheet; ComponentLink1URL: N.A.; ComponentLink2Description: Supplier link; ComponentLink2URL: N.A.; HelpURL: http://www.kingbrightusa.com/images/catalog/SPEC/APHF1608LSEEQBDZGKC.pdf; Supplier 1: Digi-Key; Supplier Part Number 1: 754-2143-1-ND; Supplier 2: N.A.; Supplier Part Number 2: N.A.; PartId: 101400123; Component Class: Optoelectronics; Author: rsk; Part number Norautron: N.A.
P1 = Pin Header 2x5 SMD, 1.27mm, KS, N.C.: Pin Header 2x5, 1.27mm (50mil), SMD, Keying Shroud; Manufacturer: W-CON; Manufacturer Part Number: 3132-10MS0BK00R1; Note: N.A.; Pad Count: 10; Part Number: Pin Header 2x5 SMD, 1.27mm, KS, N.C.; Footprint Doc: HDR_2x5-SMD-1.27mm; LatestRevisionDate: 2017-09-07; Published: 2017-09-07; Value: Pin Header 2x5, 1.27mm; Artikkelnr Noca: N.A.; Part number IPS: N.A.; ComponentLink1Description: Datasheet; ComponentLink1URL: N.A.; ComponentLink2Description: Supplier link; ComponentLink2URL: N.A.; HelpURL: \\hizz\pro\app9717\Datasheet\connectors\W-CON\3132-XXMXXBK00XX.pdf; Supplier 1: Cabcon; Supplier Part Number 1: 3132-10MS0BK00R1; Supplier 2: Samtec; Supplier Part Number 2: FTSH-105-01-F-DV-K; PartId: 100500262; Component Class: Connectors; Author: rsk; Part number Norautron: N.A.
R1 = R0201-0R: Resistor, ±5%, 0.05W; Manufacturer: N.A.; Part number IPS: 00000003245; Note: Chip Res 5%; Pad Count: 2; Part Number: R0201-0R; Manufacturer Part Number: N.A.; LatestRevisionDate: 2017-11-09; Published: 2014-11-13; Value: 0R; Artikkelnr Noca: N.A.; Footprint Doc: 0201; ComponentLink1Description: Datasheet; ComponentLink1URL: N.A.; ComponentLink2Description: Supplier link; ComponentLink2URL: N.A.; HelpURL: N.A.; Supplier 1: N.A.; Supplier Part Number 1: N.A.; Supplier 2: N.A.; Supplier Part Number 2: N.A.; PartId: 100100001; Component Class: Resistors; Author: rsk; Part number Norautron: N.A.
R2 = R0201-10k: Resistor, ±1%, 0.05W; Manufacturer: N.A.; Part number IPS: 00000001255; Note: Chip Res 1%; Pad Count: 2; Part Number: R0201-10k; Manufacturer Part Number: N.A.; LatestRevisionDate: 2014-11-13; Published: 2014-11-13; Value: 10k; Artikkelnr Noca: N.A.; Footprint Doc: 0201; ComponentLink1Description: Datasheet; ComponentLink1URL: N.A.; ComponentLink2Description: Supplier link; ComponentLink2URL: N.A.; HelpURL: N.A.; Supplier 1: N.A.; Supplier Part Number 1: N.A.; Supplier 2: N.A.; Supplier Part Number 2: N.A.; PartId: 100100065; Component Class: Resistors; Author: rsk; Part number Norautron: N.A.
R3 = R0201-220: Resistor, ±1%, 0.05W; Manufacturer: N.A.; Part number IPS: 00000000863; Note: Chip Res 1%; Pad Count: 2; Part Number: R0201-220; Manufacturer Part Number: N.A.; LatestRevisionDate: 2014-11-13; Published: 2014-11-13; Value: 220R; Artikkelnr Noca: N.A.; Footprint Doc: 0201; ComponentLink1Description: Datasheet; ComponentLink1URL: N.A.; ComponentLink2Description: Supplier link; ComponentLink2URL: N.A.; HelpURL: N.A.; Supplier 1: N.A.; Supplier Part Number 1: N.A.; Supplier 2: N.A.; Supplier Part Number 2: N.A.; PartId: 100100032; Component Class: Resistors; Author: rsk; Part number Norautron: N.A.
R4 = R0201-1k2: Resistor, ±1%, 0.05W; Manufacturer: N.A.; Part number IPS: 00000001256; Note: Chip Res 1%; Pad Count: 2; Part Number: R0201-1k2; Manufacturer Part Number: N.A.; LatestRevisionDate: 2014-11-13; Published: 2014-11-13; Value: 1k2; Artikkelnr Noca: N.A.; Footprint Doc: 0201; ComponentLink1Description: Datasheet; ComponentLink1URL: N.A.; ComponentLink2Description: Supplier link; ComponentLink2URL: N.A.; HelpURL: N.A.; Supplier 1: N.A.; Supplier Part Number 1: N.A.; Supplier 2: N.A.; Supplier Part Number 2: N.A.; PartId: 100100045; Component Class: Resistors; Author: rsk; Part number Norautron: N.A.
R5 = R0201-2k2: Resistor, ±1%, 0.05W; Manufacturer: N.A.; Part number IPS: 00000001257; Note: Chip Res 1%; Pad Count: 2; Part Number: R0201-2k2; Manufacturer Part Number: N.A.; LatestRevisionDate: 2014-11-13; Published: 2014-11-13; Value: 2k2; Artikkelnr Noca: N.A.; Footprint Doc: 0201; ComponentLink1Description: Datasheet; ComponentLink1URL: N.A.; ComponentLink2Description: Supplier link; ComponentLink2URL: N.A.; HelpURL: N.A.; Supplier 1: N.A.; Supplier Part Number 1: N.A.; Supplier 2: N.A.; Supplier Part Number 2: N.A.; PartId: 100100052; Component Class: Resistors; Author: rsk; Part number Norautron: N.A.
R6 = R0201-390: Resistor, ±1%, 0.05W; Manufacturer: N.A.; Part number IPS: 00000001258; Note: Chip Res 1%; Pad Count: 2; Part Number: R0201-390; Manufacturer Part Number: N.A.; LatestRevisionDate: 2014-11-13; Published: 2014-11-13; Value: 390R; Artikkelnr Noca: N.A.; Footprint Doc: 0201; ComponentLink1Description: Datasheet; ComponentLink1URL: N.A.; ComponentLink2Description: Supplier link; ComponentLink2URL: N.A.; HelpURL: N.A.; Supplier 1: N.A.; Supplier Part Number 1: N.A.; Supplier 2: N.A.; Supplier Part Number 2: N.A.; PartId: 100100035; Component Class: Resistors; Author: rsk; Part number Norautron: N.A.
R7 = R0201-4R7: Resistor, ±1%, 0.05W; Manufacturer: N.A.; Part number IPS: 00000002486; Note: Chip Res 1%; Pad Count: 2; Part Number: R0201-4R7; Manufacturer Part Number: N.A.; LatestRevisionDate: 2014-11-13; Published: 2014-11-13; Value: 4R7; Artikkelnr Noca: N.A.; Footprint Doc: 0201; ComponentLink1Description: Datasheet; ComponentLink1URL: N.A.; ComponentLink2Description: Supplier link; ComponentLink2URL: N.A.; HelpURL: N.A.; Supplier 1: N.A.; Supplier Part Number 1: N.A.; Supplier 2: N.A.; Supplier Part Number 2: N.A.; PartId: 100100010; Component Class: Resistors; Author: rsk; Part number Norautron: N.A.
SB1 = Solderbridge: Manufacturer: N.A.; Pad Count: 2; Part Number: Solderbridge; Manufacturer Part Number: N.A.; Footprint Doc: Solderbridge; LatestRevisionDate: 2009-12-14; Published: 2009-12-14; Value: Solderbridge; Note: N.A.; Artikkelnr Noca: N.A.; Part number IPS: N.A.; ComponentLink1Description: Datasheet; ComponentLink1URL: N.A.; ComponentLink2Description: Supplier link; ComponentLink2URL: N.A.; HelpURL: N.A.; Supplier 1: N.A.; Supplier Part Number 1: N.A.; Supplier 2: N.A.; Supplier Part Number 2: N.A.; PartId: 100500458; Component Class: Connectors; Author: rsk; Part number Norautron: N.A.
SB2-SB4 = Solderbridge Shorted: Shorted Solderbridge; Manufacturer: N.A.; Pad Count: 2; Part Number: Solderbridge Shorted; Manufacturer Part Number: N.A.; Footprint Doc: Solderbridge_Shorted; LatestRevisionDate: 2012-08-07; Published: 2012-08-07; Value: Solderbridge; Note: N.A.; Artikkelnr Noca: N.A.; Part number IPS: N.A.; ComponentLink1Description: Datasheet; ComponentLink1URL: N.A.; ComponentLink2Description: Supplier link; ComponentLink2URL: N.A.; HelpURL: N.A.; Supplier 1: N.A.; Supplier Part Number 1: N.A.; Supplier 2: N.A.; Supplier Part Number 2: N.A.; PartId: 100500459; Component Class: Connectors; Author: rsk; Part number Norautron: N.A.
SW1 = PTS810 SJK 250 SMTR LFS: Tactile Switch, SPNO, SMD, 260gf, 4.2x3.2x2.5mm; Manufacturer: C&K; Part number IPS: 00000001259; Note: N.A.; Pad Count: 4; Part Number: PTS810 SJK 250 SMTR LFS; Manufacturer Part Number: PTS810 SJK 250 SMTR LFS; LatestRevisionDate: 2017-11-09; Published: 2017-09-18; Value: PB SW; Artikkelnr Noca: N.A.; Footprint Doc: PTS810; ComponentLink1Description: Datasheet; ComponentLink1URL: N.A.; ComponentLink2Description: Supplier link; ComponentLink2URL: N.A.; HelpURL: http://www.ckswitches.com/media/1476/pts810.pdf; Supplier 1: Digi-Key; Supplier Part Number 1: CKN10503TR-ND; Supplier 2: N.A.; Supplier Part Number 2: N.A.; PartId: 101500104; Component Class: Switches; Author: rsk; Part number Norautron: N.A.
SW2 = PTS840 GK SMTR LFS: Microminiature SMT Switch, Side Actuated; Manufacturer: C&K; Part number IPS: 00000001260; Part number Norautron: N.A.; Note: Tactile Switch, SPST, SMD, 220gf; Artikkelnr Noca: 50019089; Pad Count: 4; Part Number: PTS840 GK SMTR LFS; Manufacturer Part Number: PTS840 GK SMTR LFS; LatestRevisionDate: 2017-11-09; Published: 2014-08-12; Value: PTS840 GK SMTR LFS; Footprint Doc: PTS840 Gx; ComponentLink1Description: Datasheet; ComponentLink1URL: N.A.; ComponentLink2Description: Supplier link; ComponentLink2URL: N.A.; HelpURL: http://www.ck-components.com/80185/pts840_11june13.pdf/; Supplier 1: Digi-Key; Supplier Part Number 1: CKN10508CT-ND; Supplier 2: Mouser; Supplier Part Number 2: 611-PTS840GKSMTR; PartId: 101500010; Component Class: Switches; Author: rsk
SWDCLK SWDIO = Castellated Hole 0.9mm_D: Castellated Hole 0.9mm; Manufacturer: N.A.; Pad Count: 1; Part Number: Castellated Hole 0.9mm_D; Manufacturer Part Number: N.A.; LatestRevisionDate: 2018-01-24; Published: 2018-01-24; Value: CH; Note: N.A.; Artikkelnr Noca: N.A.; Part number IPS: N.A.; ComponentLink1Description: Datasheet; ComponentLink1URL: N.A.; ComponentLink2Description: Supplier link; ComponentLink2URL: N.A.; HelpURL: N.A.; Supplier 1: N.A.; Supplier Part Number 1: N.A.; Supplier 2: N.A.; Supplier Part Number 2: N.A.; Footprint Doc: N.A.; PartId: 100500567; Component Class: Connectors; Author: rsk; Part number Norautron: N.A.
U1 = nRF52840-QIAAF0: Multi-protocol Bluetooth Low Energy, IEEE 802.15.4, ANT and 2.4GHz proprietary system-on-chip; Manufacturer: Nordic Semiconductor; Note: N.A.; Pad Count: 73; Part Number: nRF52840-QIAAF0; LatestRevisionDate: 2021-03-24; Published: 2021-03-24; Value: nRF52840-QIAA; Footprint Doc: AQFN-73; Manufacturer Part Number: nRF52840-QIAAF0; Artikkelnr Noca: N.A.; Part number IPS: N.A.; ComponentLink1Description: Datasheet; ComponentLink1URL: N.A.; ComponentLink2Description: Supplier link; ComponentLink2URL: N.A.; HelpURL: N.A.; Supplier 1: Nordic Semiconductor; Supplier Part Number 1: nRF52840-QIAAF0; Supplier 2: N.A.; Supplier Part Number 2: N.A.; Component Class: nRF_Devices; Author: hany; Part number Norautron: N.A.
X1 = XTAL_SMD2016_32MHz_8pF_Murata: XTAL SMD 2016, 32MHz, Cl=8pF, Tol: ±10ppm, Stab: ±10ppm; Manufacturer: Murata; Manufacturer Part Number: XRCGB32M000F1H01R0; Part number IPS: 80000001424; Note: XTAL SMD 32.000MHz; Artikkelnr Noca: N.A.; Pad Count: 4; Part Number: XTAL_SMD2016_32MHz_8pF_Murata; LatestRevisionDate: 2020-09-17; Published: 2016-10-26; Value: 32MHz; Footprint Doc: XTAL_2016; ComponentLink1Description: Datasheet; ComponentLink1URL: N.A.; ComponentLink2Description: Supplier link; ComponentLink2URL: N.A.; HelpURL: http://www.murata.com/en-global/products/productdetail.aspx?cate=cgsubCrystalUnits&partno=XRCGB32M000F1H01R0; Supplier 1: N.A.; Supplier Part Number 1: N.A.; Supplier 2: N.A.; Supplier Part Number 2: N.A.; PartId: 101600040; Component Class: Oscillators; Author: rsk; Part number Norautron: N.A.
X2 = XTAL_SMD2012_32.768kHz_9pF_Seiko: XTAL SMD 2012, 32.768kHz, 9pF, ±20ppm; Manufacturer: Seiko Instruments; Manufacturer Part Number: SC20S-9.0PF20PPM; Part number IPS: 80000001425; Note: XTAL SMD 32.768kHz; Artikkelnr Noca: N.A.; Pad Count: 2; Part Number: XTAL_SMD2012_32.768kHz_9pF_Seiko; LatestRevisionDate: 2017-11-09; Published: 2015-10-15; Value: 32.768kHz; Footprint Doc: XTAL_2012; ComponentLink1Description: Datasheet; ComponentLink1URL: N.A.; ComponentLink2Description: Supplier link; ComponentLink2URL: N.A.; HelpURL: http://www.sii.co.jp/en/quartz/files/2013/03/file_PRODUCT_MASTER_50811_GRAPHIC03.pdf; Supplier 1: N.A.; Supplier Part Number 1: N.A.; Supplier 2: N.A.; Supplier Part Number 2: N.A.; PartId: 101600015; Component Class: Oscillators; Author: rsk; Part number Norautron: N.A.